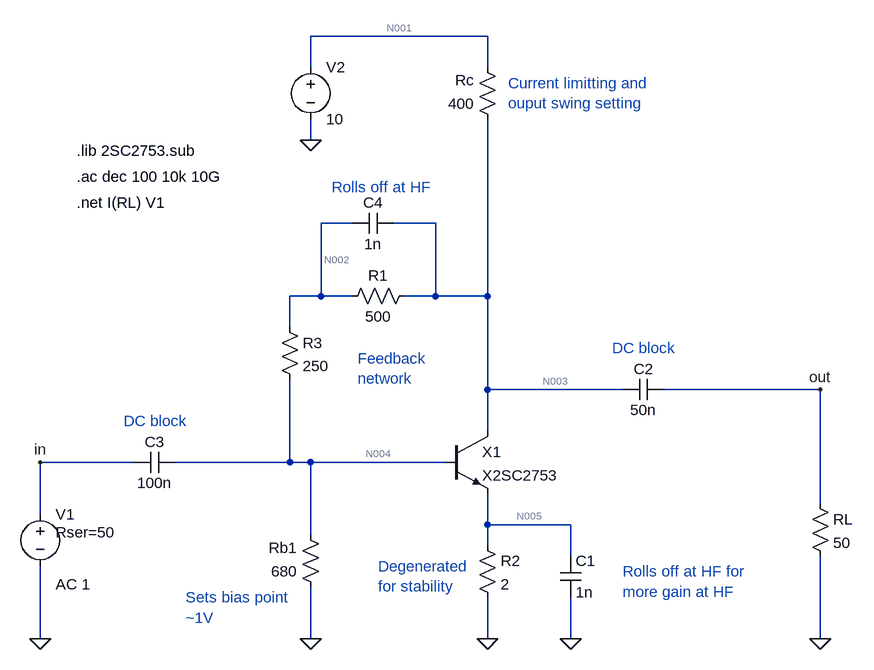
[diagram p0: schematic broadband.asc]
broadband.asc, the LTspice schematic file:
Version 4
SHEET 1 1204 680
WIRE 512 -384 240 -384
WIRE 240 -336 240 -384
WIRE 512 -336 512 -384
WIRE 240 -224 240 -256
WIRE 304 -96 256 -96
WIRE 432 -96 368 -96
WIRE 256 16 256 -96
WIRE 256 16 208 16
WIRE 304 16 256 16
WIRE 432 16 432 -96
WIRE 432 16 384 16
WIRE 512 16 512 -256
WIRE 512 16 432 16
WIRE 208 64 208 16
WIRE 512 160 512 16
WIRE 720 160 512 160
WIRE 1024 160 784 160
WIRE 512 224 512 160
WIRE -32 272 -176 272
WIRE 208 272 208 144
WIRE 208 272 32 272
WIRE 240 272 208 272
WIRE 448 272 240 272
WIRE 1024 336 1024 160
WIRE -176 352 -176 272
WIRE 512 368 512 320
WIRE 640 368 512 368
WIRE 240 384 240 272
WIRE 512 400 512 368
WIRE 640 416 640 368
WIRE -176 544 -176 432
WIRE 240 544 240 464
WIRE 512 544 512 480
WIRE 640 544 640 480
WIRE 1024 544 1024 416
FLAG 512 544 0
FLAG 240 544 0
FLAG -176 544 0
FLAG 240 -224 0
FLAG 1024 544 0
FLAG 1024 160 out
FLAG 640 544 0
FLAG -176 272 in
SYMBOL npn 448 224 R0
SYMATTR InstName X1
SYMATTR Value X2SC2753
SYMATTR Prefix X
SYMBOL res 528 -240 R180
WINDOW 0 36 76 Left 2
WINDOW 3 36 40 Left 2
SYMATTR InstName Rc
SYMATTR Value 400
SYMBOL res 256 480 R180
WINDOW 0 36 76 Left 2
WINDOW 3 36 40 Left 2
SYMATTR InstName Rb1
SYMATTR Value 680
SYMBOL cap 784 144 R90
WINDOW 0 0 32 VBottom 2
WINDOW 3 32 32 VTop 2
SYMATTR InstName C2
SYMATTR Value 50n
SYMBOL res 1008 320 R0
SYMATTR InstName RL
SYMATTR Value 50
SYMBOL voltage -176 336 R0
WINDOW 123 24 124 Left 2
WINDOW 39 24 44 Left 2
SYMATTR Value2 AC 1
SYMATTR SpiceLine Rser=50
SYMATTR InstName V1
SYMATTR Value ""
SYMBOL voltage 240 -352 R0
WINDOW 123 0 0 Left 0
WINDOW 39 0 0 Left 0
SYMATTR InstName V2
SYMATTR Value 10
SYMBOL res 400 0 R90
WINDOW 0 0 56 VBottom 2
WINDOW 3 32 56 VTop 2
SYMATTR InstName R1
SYMATTR Value 500
SYMBOL res 496 384 R0
SYMATTR InstName R2
SYMATTR Value 2
SYMBOL cap 624 416 R0
SYMATTR InstName C1
SYMATTR Value 1n
SYMBOL res 192 48 R0
SYMATTR InstName R3
SYMATTR Value 250
SYMBOL cap 368 -112 R90
WINDOW 0 0 32 VBottom 2
WINDOW 3 32 32 VTop 2
SYMATTR InstName C4
SYMATTR Value 1n
SYMBOL cap 32 256 R90
WINDOW 0 0 32 VBottom 2
WINDOW 3 32 32 VTop 2
SYMATTR InstName C3
SYMATTR Value 100n
TEXT -120 -208 Left 2 !.lib 2SC2753.sub
TEXT -120 -168 Left 2 !.ac dec 100 10k 10G
TEXT -120 -128 Left 2 !.net I(RL) V1
TEXT -48 208 Left 2 ;DC block
TEXT 704 96 Left 2 ;DC block
TEXT 344 432 Left 2 ;Degenerated\nfor stability
TEXT 720 440 Left 2 ;Rolls off at HF for \nmore gain at HF
TEXT 544 -312 Left 2 ;Current limitting and \nouput swing setting
TEXT 312 112 Left 2 ;Feedback\nnetwork
TEXT 272 -152 Left 2 ;Rolls off at HF
TEXT 48 480 Left 2 ;Sets bias point\n~1V

The netlist it stands for:
* broadband.asc
XX1 N003 N004 N005 X2SC2753  ; pins C B E
Rc N003 N001 400
Rb1 0 N004 680
C2 out N003 50n
RL out 0 50
V1 in 0 AC 1 Rser=50
V2 N001 0 10
R1 N003 N002 500
R2 N005 0 2
C1 N005 0 1n
R3 N002 N004 250
C4 N003 N002 1n
C3 N004 in 100n
.lib 2SC2753.sub
.ac dec 100 10k 10G
.net I(RL) V1
* DC block
* DC block
* Degenerated
* for stability
* Rolls off at HF for
* more gain at HF
* Current limitting and
* ouput swing setting
* Feedback
* network
* Rolls off at HF
* Sets bias point
* ~1V
.backanno
.end

* Results of the author's LTspice run, read from the files saved beside the schematic
* Operating Point, zero values left out:
*   V(n004) = 884.9 mV
*   V(n003) = 2.058 V
*   V(n005) = 37.11 mV
*   V(n001) = 10 V
*   V(n002) = 1.276 V
*   I(R3) = 1.564 mA
*   I(R2) = 18.55 mA
*   I(R1) = 1.564 mA
*   I(Rb1) = -1.301 mA
*   I(Rc) = -19.86 mA
*   I(V2) = -19.86 mA
*   Ix(x1:C1) = 18.29 mA
*   Ix(x1:B1) = 262.5 µA
*   Ix(x1:E1) = -18.55 mA
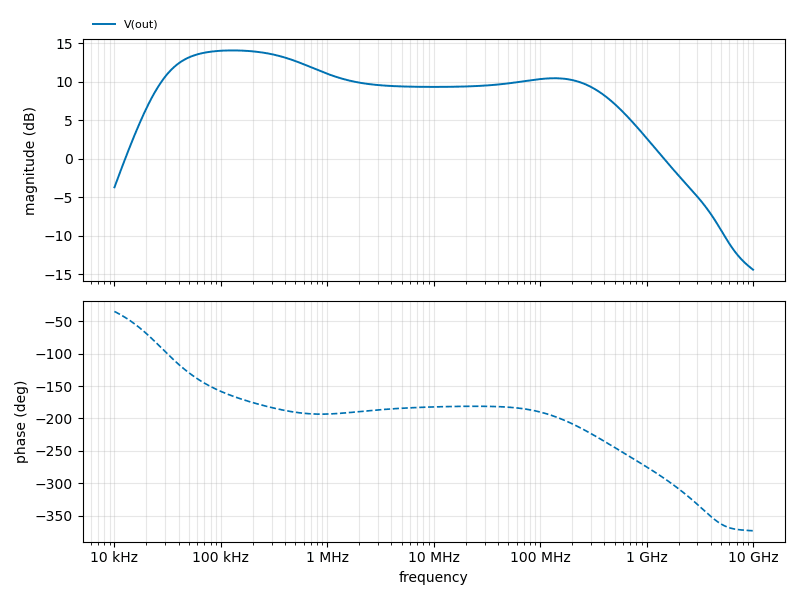
[diagram p1: AC Analysis of broadband.asc, plotted from the saved traces]
* AC Analysis, 1 run:
*   V(out): -3.72 dB at 10 kHz, -14.44 dB at 10 GHz, peak 14.08 dB at 128.8 kHz, 3 dB below the peak at 31.65 kHz and 987.2 kHz